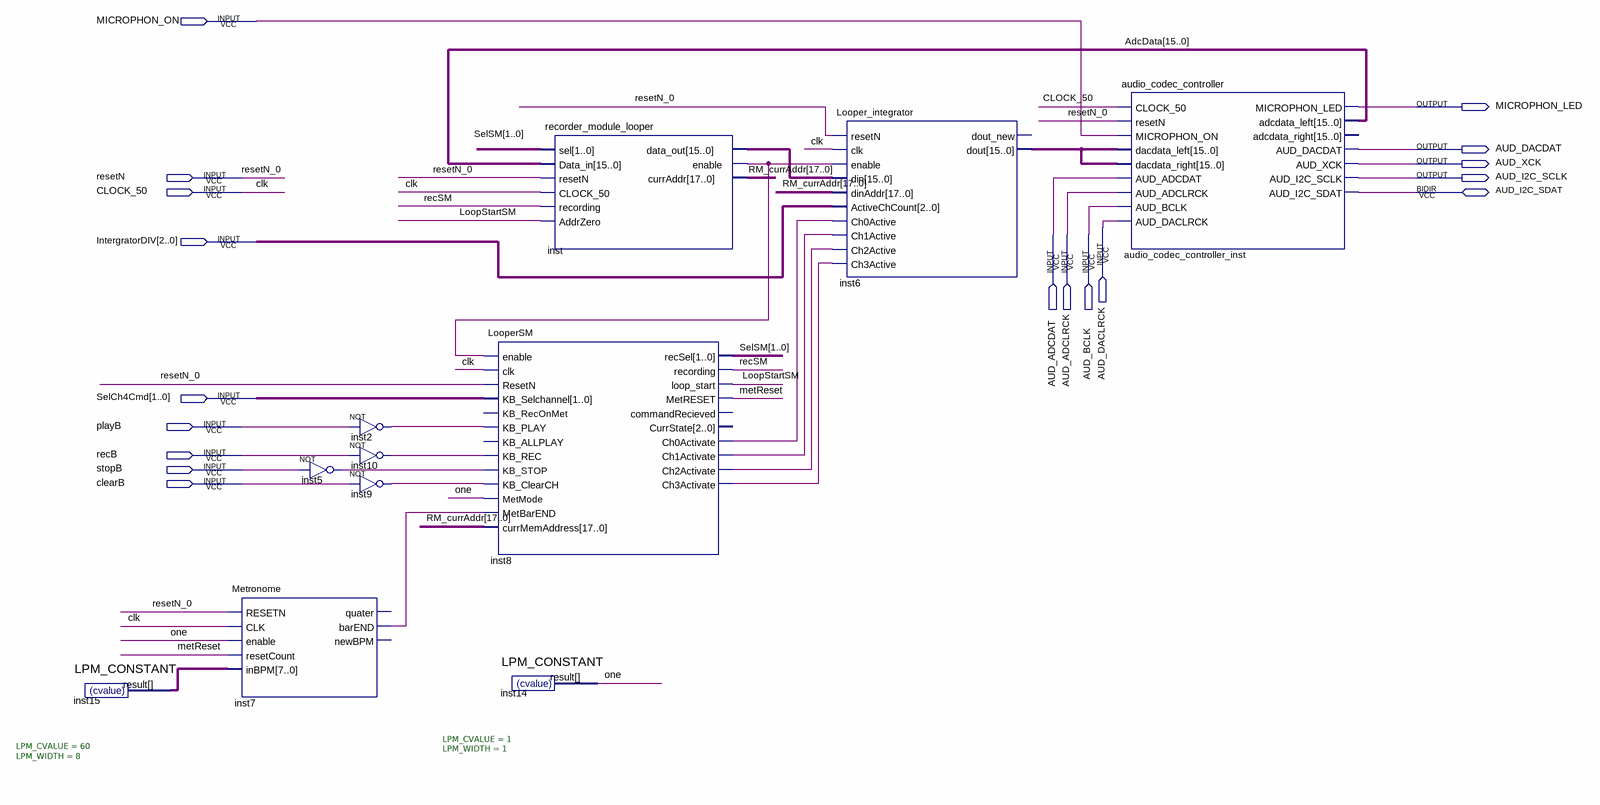
[diagram p0: schematic sheet]
// Quartus schematic experiement_digital_recorder.bdf as structural Verilog: 11 symbols, 18 pins
module experiement_digital_recorder (
  input  MICROPHON_ON,
  input  resetN,
  input  CLOCK_50,
  input  AUD_DACLRCK,
  input  AUD_ADCDAT,
  input  AUD_ADCLRCK,
  input  AUD_BCLK,
  input  [2:0] IntergratorDIV,
  input  [1:0] SelCh4Cmd,
  input  playB,
  input  recB,
  input  stopB,
  input  clearB,
  inout  AUD_I2C_SDAT,
  output MICROPHON_LED,
  output AUD_DACDAT,
  output AUD_XCK,
  output AUD_I2C_SCLK
);

  wire inst2_out, inst5_out, inst7_barend, inst8_ch0activate, inst8_ch1activate, inst8_ch2activate,
       inst8_ch3activate, inst9_out, inst10_out, inst_enable, LoopStartSM, metReset, one, recSM;
  wire [1:0] SelSM;
  wire [7:0] inst15_result;
  wire [15:0] AdcData, inst6_dout, inst_data_out;
  wire [17:0] RM_currAddr;

  LPM_CONSTANT #(.LPM_CVALUE(60), .LPM_WIDTH(8)) inst15 (.result(inst15_result));
  Metronome inst7 (
    .RESETN(resetN), .CLK(CLOCK_50), .enable(one), .resetCount(metReset), .inBPM(inst15_result),
    .barEND(inst7_barend));  // open: quater, newBPM
  not inst5 (inst5_out, stopB);
  not inst2 (inst2_out, playB);
  not inst10 (inst10_out, recB);
  not inst9 (inst9_out, clearB);
  LooperSM inst8 (
    .enable(inst_enable), .clk(CLOCK_50), .ResetN(resetN), .KB_Selchannel(SelCh4Cmd), .KB_PLAY(inst2_out),
    .KB_REC(inst10_out), .KB_STOP(inst5_out), .KB_ClearCH(inst9_out), .MetMode(one),
    .MetBarEND(inst7_barend), .currMemAddress(RM_currAddr), .recSel(SelSM), .recording(recSM),
    .loop_start(LoopStartSM), .MetRESET(metReset), .Ch0Activate(inst8_ch0activate),
    .Ch1Activate(inst8_ch1activate), .Ch2Activate(inst8_ch2activate), .Ch3Activate(inst8_ch3activate));  // open: KB_RecOnMet, KB_ALLPLAY, commandRecieved, CurrState
  LPM_CONSTANT #(.LPM_CVALUE(1), .LPM_WIDTH(1)) inst14 (.result(one));
  recorder_module_looper inst (
    .sel(SelSM), .Data_in(AdcData), .resetN(resetN), .CLOCK_50(CLOCK_50), .recording(recSM),
    .AddrZero(LoopStartSM), .data_out(inst_data_out), .enable(inst_enable), .currAddr(RM_currAddr));
  Looper_integrator inst6 (
    .resetN(resetN), .clk(CLOCK_50), .enable(inst_enable), .din(inst_data_out), .dinAddr(RM_currAddr),
    .ActiveChCount(IntergratorDIV), .Ch0Active(inst8_ch0activate), .Ch1Active(inst8_ch1activate),
    .Ch2Active(inst8_ch2activate), .Ch3Active(inst8_ch3activate), .dout(inst6_dout));  // open: dout_new
  audio_codec_controller audio_codec_controller_inst (
    .CLOCK_50(CLOCK_50), .resetN(resetN), .MICROPHON_ON(MICROPHON_ON), .dacdata_left(inst6_dout),
    .dacdata_right(inst6_dout), .AUD_ADCDAT(AUD_ADCDAT), .AUD_ADCLRCK(AUD_ADCLRCK), .AUD_BCLK(AUD_BCLK),
    .AUD_DACLRCK(AUD_DACLRCK), .MICROPHON_LED(MICROPHON_LED), .adcdata_left(AdcData),
    .AUD_DACDAT(AUD_DACDAT), .AUD_XCK(AUD_XCK), .AUD_I2C_SCLK(AUD_I2C_SCLK), .AUD_I2C_SDAT(AUD_I2C_SDAT));  // open: adcdata_right

  // Other names for the same wires on the sheet: clk = CLOCK_50; resetN_0 = resetN
endmodule
